# EAGLE schematic Gen6 REV0.1 (EAGLE 8.3.1)
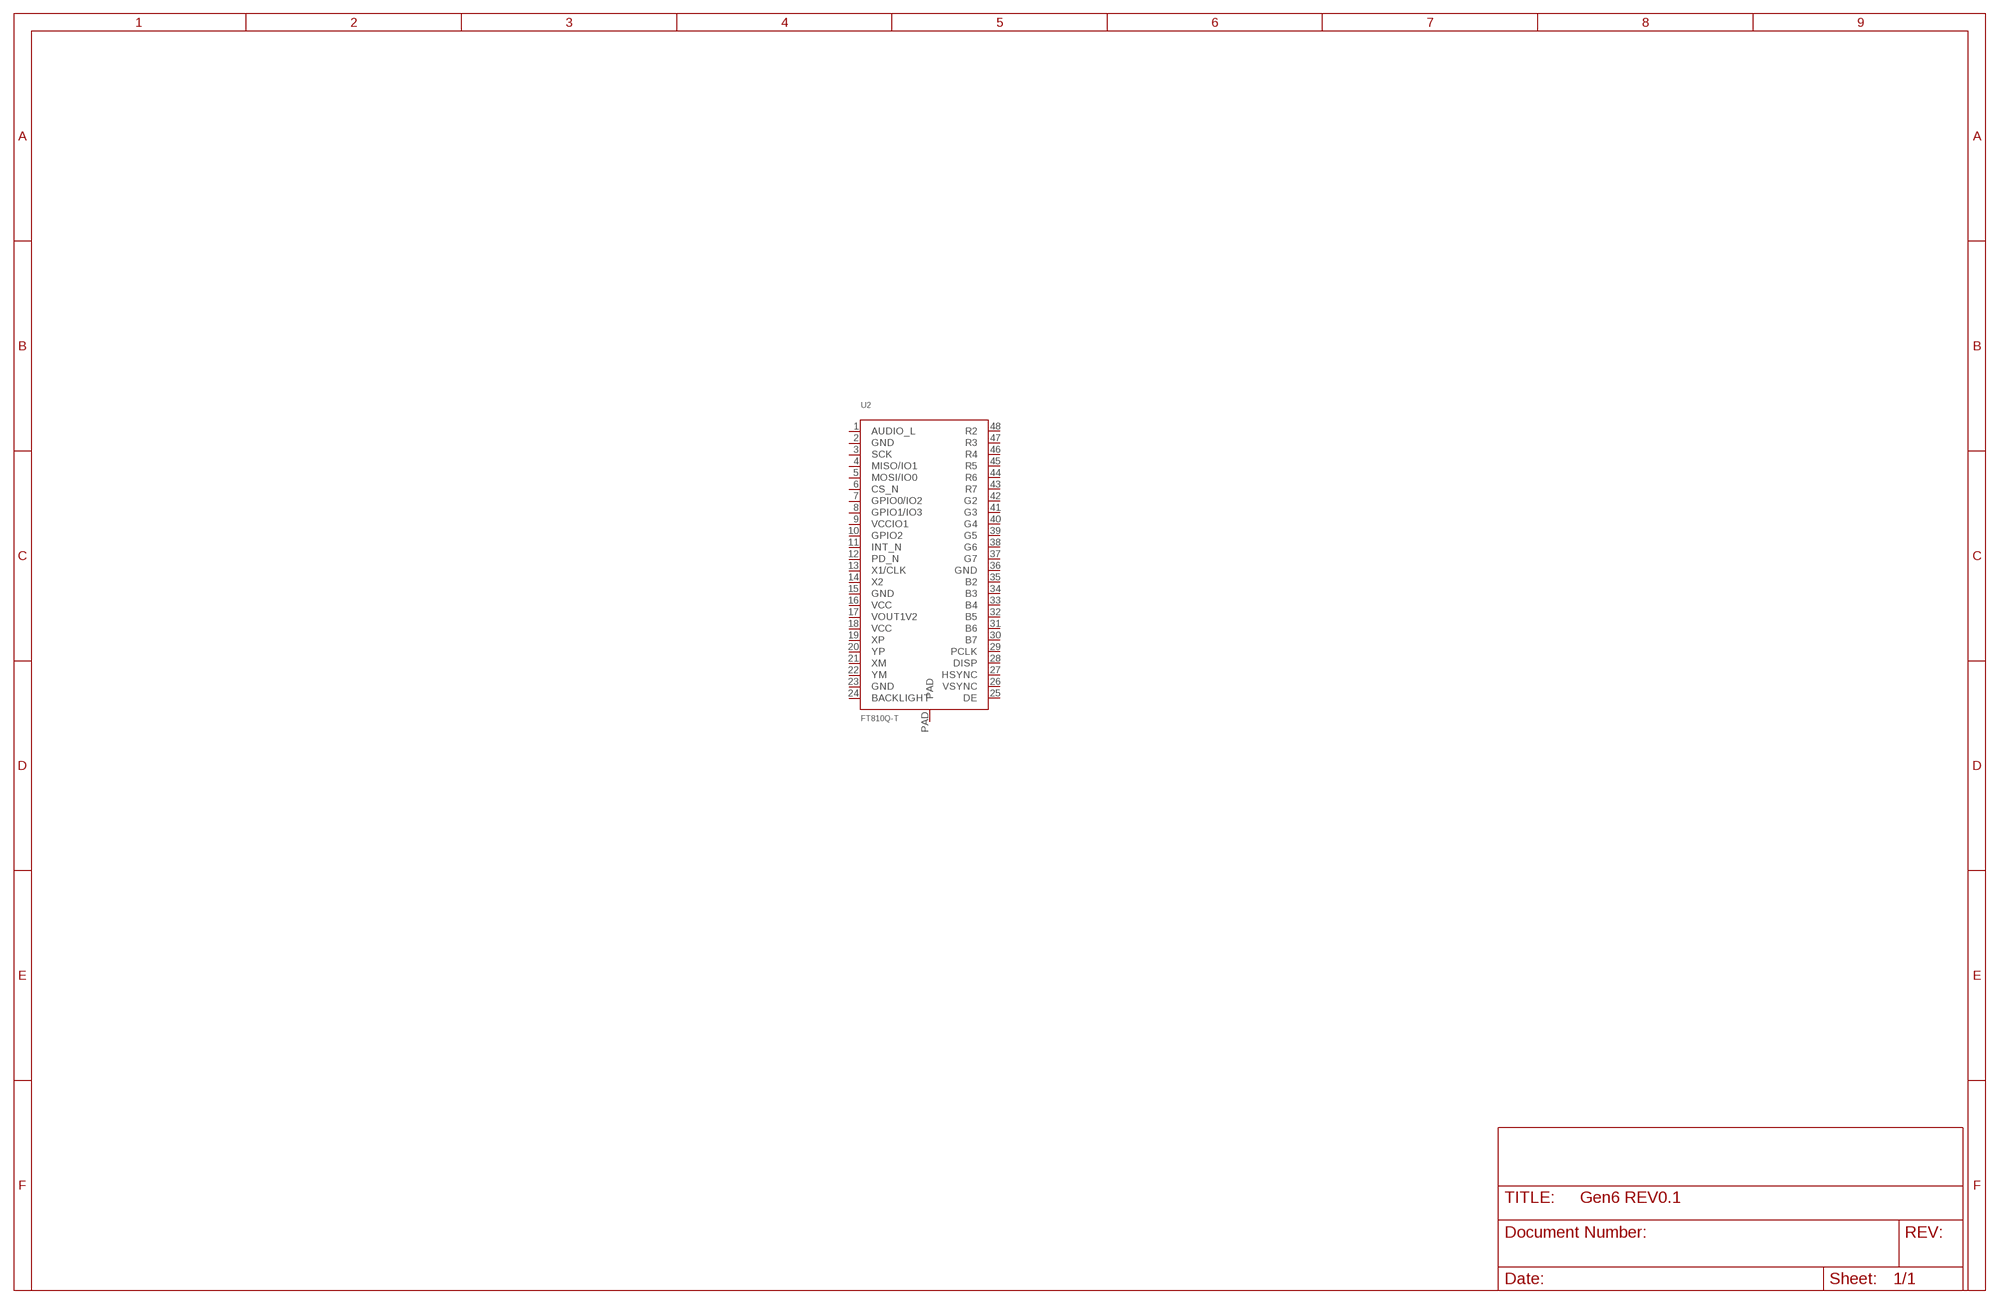
[diagram p0: schematic, sheet 1]

## Parts
U2  FT810Q-T  [FT810Q-T]
Unconnected: U2.1(AUDIO_L) U2.3(SCK) U2.4(MISO/IO1) U2.5(MOSI/IO0) U2.6(CS_N) U2.7(GPIO0/IO2) U2.8(GPIO1/IO3) U2.10(GPIO2) U2.11(INT_N) U2.12(PD_N) U2.13(X1/CLK) U2.14(X2) U2.19(XP) U2.20(YP) U2.21(XM) U2.22(YM) U2.24(BACKLIGHT) U2.25(DE) U2.26(VSYNC) U2.27(HSYNC) U2.28(DISP) U2.29(PCLK) U2.30(B7) U2.31(B6) U2.32(B5) U2.33(B4) U2.34(B3) U2.35(B2) U2.37(G7) U2.38(G6) U2.39(G5) U2.40(G4) U2.41(G3) U2.42(G2) U2.43(R7) U2.44(R6) U2.45(R5) U2.46(R4) U2.47(R3) U2.48(R2)

## Power pins joined to a net without a drawn wire
GND: U2.2(GND) U2.15(GND) U2.23(GND) U2.36(GND)
PAD: U2.PAD
VCC: U2.16(VCC) U2.18(VCC)
VCCIO1: U2.9(VCCIO1)
VOUT1V2: U2.17(VOUT1V2)

## Library data of the parts
U2 = clackboard_lib:FT810Q-T